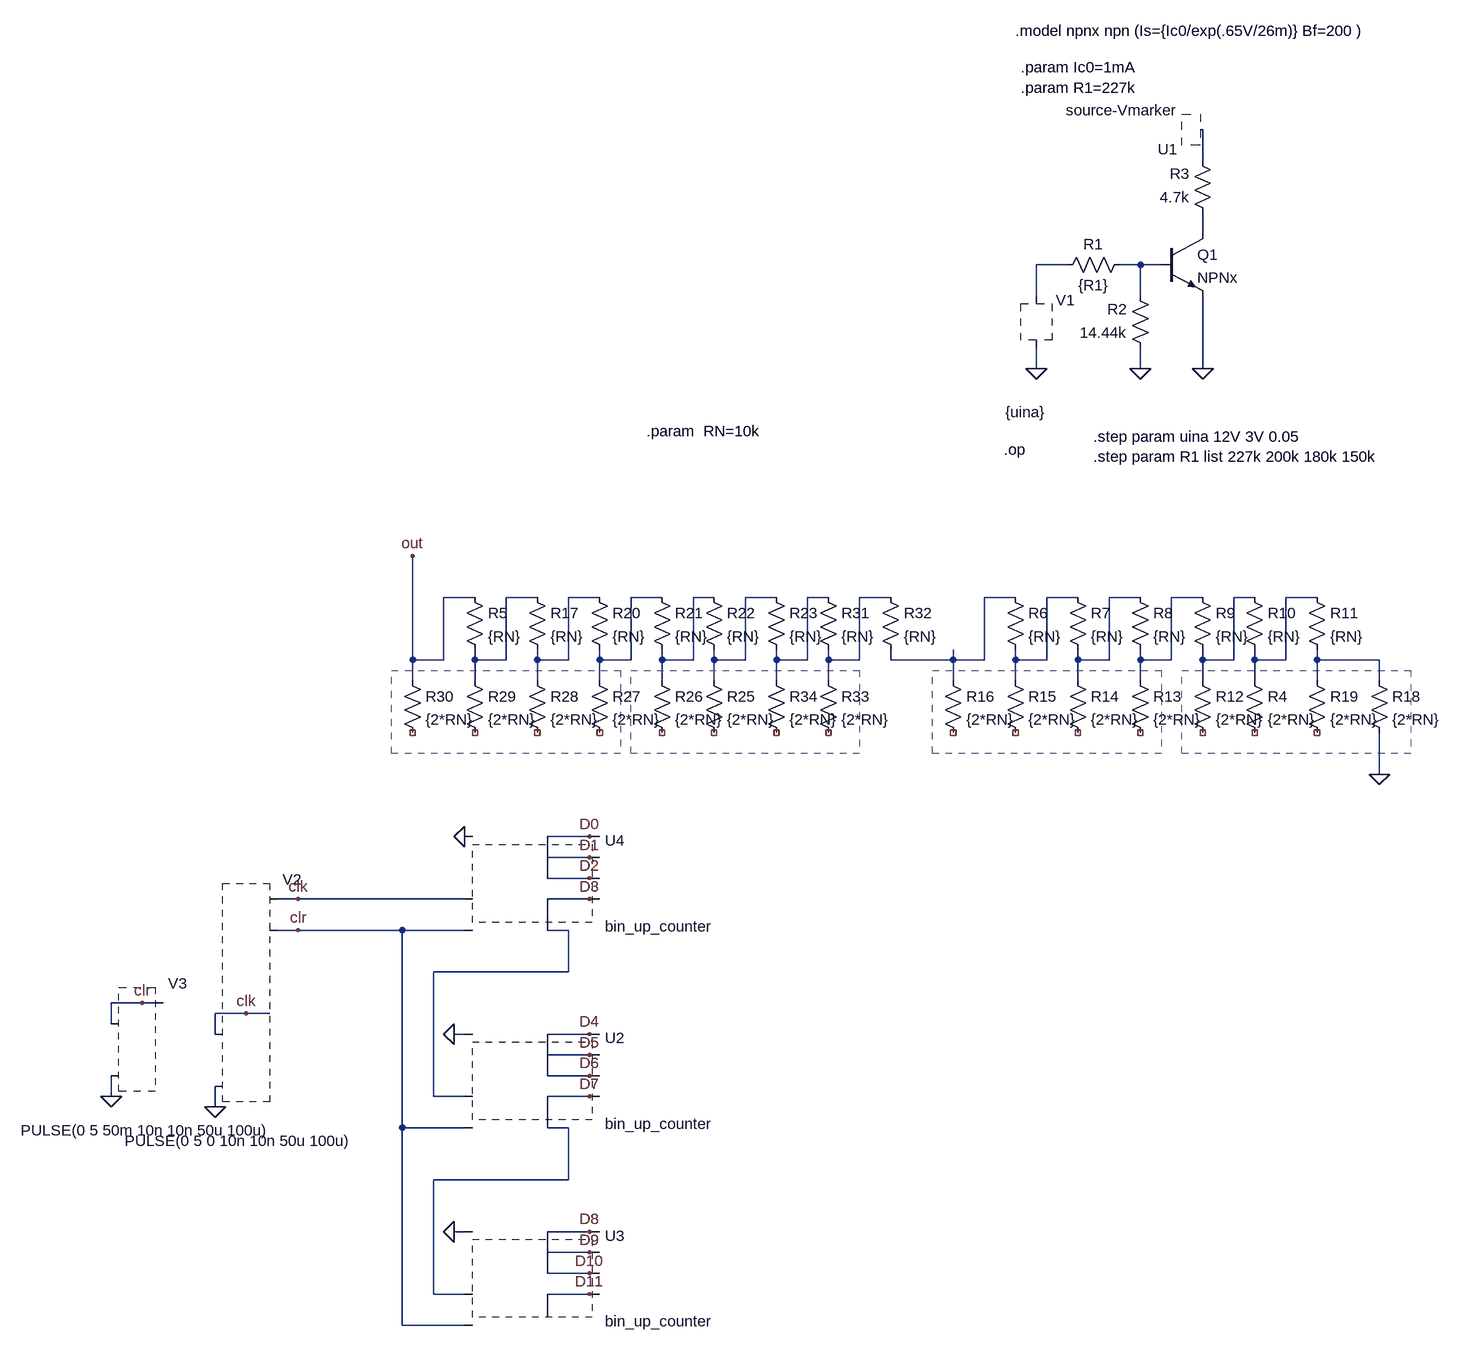
[diagram p0: schematic DAC_R2R_netzwerk.asc]
DAC_R2R_netzwerk.asc, the LTspice schematic file:
Version 4
SHEET 1 880 1584
WIRE 176 -256 176 -304
WIRE 176 -144 176 -176
WIRE -32 -96 -80 -96
WIRE 80 -96 48 -96
WIRE 112 -96 80 -96
WIRE -80 -48 -80 -96
WIRE 80 -48 80 -96
WIRE -80 64 -80 32
WIRE 80 64 80 32
WIRE 176 64 176 -48
WIRE -944 416 -992 416
WIRE -848 416 -896 416
WIRE -752 416 -800 416
WIRE -656 416 -704 416
WIRE -576 416 -608 416
WIRE -480 416 -528 416
WIRE -400 416 -432 416
WIRE -304 416 -352 416
WIRE -112 416 -160 416
WIRE -16 416 -64 416
WIRE 80 416 32 416
WIRE 176 416 128 416
WIRE 256 416 224 416
WIRE 352 416 304 416
WIRE -1040 512 -1040 352
WIRE -992 512 -992 416
WIRE -992 512 -1040 512
WIRE -944 512 -944 496
WIRE -896 512 -896 416
WIRE -896 512 -944 512
WIRE -848 512 -848 496
WIRE -800 512 -800 416
WIRE -800 512 -848 512
WIRE -752 512 -752 496
WIRE -704 512 -704 416
WIRE -704 512 -752 512
WIRE -656 512 -656 496
WIRE -608 512 -608 416
WIRE -608 512 -656 512
WIRE -576 512 -576 496
WIRE -528 512 -528 416
WIRE -528 512 -576 512
WIRE -480 512 -480 496
WIRE -432 512 -432 416
WIRE -432 512 -480 512
WIRE -400 512 -400 496
WIRE -352 512 -352 416
WIRE -352 512 -400 512
WIRE -304 512 -304 496
WIRE -208 512 -208 496
WIRE -208 512 -304 512
WIRE -160 512 -160 416
WIRE -160 512 -208 512
WIRE -112 512 -112 496
WIRE -64 512 -64 416
WIRE -64 512 -112 512
WIRE -16 512 -16 496
WIRE 32 512 32 416
WIRE 32 512 -16 512
WIRE 80 512 80 496
WIRE 128 512 128 416
WIRE 128 512 80 512
WIRE 176 512 176 496
WIRE 224 512 224 416
WIRE 224 512 176 512
WIRE 256 512 256 496
WIRE 304 512 304 416
WIRE 304 512 256 512
WIRE 352 512 352 496
WIRE 448 512 352 512
WIRE -1040 544 -1040 512
WIRE -944 544 -944 512
WIRE -848 544 -848 512
WIRE -752 544 -752 512
WIRE -656 544 -656 512
WIRE -576 544 -576 512
WIRE -480 544 -480 512
WIRE -400 544 -400 512
WIRE -208 544 -208 512
WIRE -112 544 -112 512
WIRE -16 544 -16 512
WIRE 80 544 80 512
WIRE 176 544 176 512
WIRE 256 544 256 512
WIRE 352 544 352 512
WIRE 448 544 448 512
WIRE 448 688 448 624
WIRE -768 784 -832 784
WIRE -752 784 -768 784
WIRE -768 816 -832 816
WIRE -752 816 -768 816
WIRE -768 848 -832 848
WIRE -752 848 -768 848
WIRE -1216 880 -1248 880
WIRE -960 880 -1216 880
WIRE -768 880 -832 880
WIRE -752 880 -768 880
WIRE -1216 928 -1248 928
WIRE -1056 928 -1216 928
WIRE -960 928 -1056 928
WIRE -800 928 -832 928
WIRE -800 992 -800 928
WIRE -800 992 -1008 992
WIRE -1456 1040 -1504 1040
WIRE -1424 1040 -1456 1040
WIRE -1296 1056 -1344 1056
WIRE -1264 1056 -1296 1056
WIRE -1504 1072 -1504 1040
WIRE -1344 1088 -1344 1056
WIRE -960 1088 -976 1088
WIRE -768 1088 -832 1088
WIRE -752 1088 -768 1088
WIRE -768 1120 -832 1120
WIRE -752 1120 -768 1120
WIRE -768 1152 -832 1152
WIRE -752 1152 -768 1152
WIRE -1504 1184 -1504 1152
WIRE -1008 1184 -1008 992
WIRE -960 1184 -1008 1184
WIRE -768 1184 -832 1184
WIRE -752 1184 -768 1184
WIRE -1344 1200 -1344 1168
WIRE -1056 1232 -1056 928
WIRE -960 1232 -1056 1232
WIRE -800 1232 -832 1232
WIRE -800 1312 -800 1232
WIRE -800 1312 -1008 1312
WIRE -960 1392 -976 1392
WIRE -768 1392 -832 1392
WIRE -752 1392 -768 1392
WIRE -768 1424 -832 1424
WIRE -752 1424 -768 1424
WIRE -768 1456 -832 1456
WIRE -752 1456 -768 1456
WIRE -1008 1488 -1008 1312
WIRE -960 1488 -1008 1488
WIRE -768 1488 -832 1488
WIRE -752 1488 -768 1488
WIRE -1056 1536 -1056 1232
WIRE -960 1536 -1056 1536
FLAG 80 64 0
FLAG 176 64 0
FLAG -80 64 0
FLAG 448 688 0
FLAG -1040 352 out
FLAG -1344 1200 0
FLAG -1296 1056 clk
FLAG -768 784 D0
FLAG -768 816 D1
FLAG -768 848 D2
FLAG -768 880 D3
FLAG -768 1088 D4
FLAG -768 1120 D5
FLAG -768 1152 D6
FLAG -768 1184 D7
FLAG -768 1392 D8
FLAG -768 1424 D9
FLAG -768 1456 D10
FLAG -768 1488 D11
FLAG -976 1088 0
FLAG -976 1392 0
FLAG -1216 880 clk
FLAG -960 784 0
FLAG -1504 1184 0
FLAG -1456 1040 clr
FLAG -1216 928 clr
SYMBOL EIT_Semiconductors\\npn 112 -144 R0
SYMATTR InstName Q1
SYMATTR Value NPNx
SYMBOL res 64 -112 R90
WINDOW 0 0 56 VBottom 2
WINDOW 3 32 56 VTop 2
SYMATTR InstName R1
SYMATTR Value {R1}
SYMBOL res 96 48 R180
WINDOW 0 36 76 Left 2
WINDOW 3 36 40 Left 2
SYMATTR InstName R2
SYMATTR Value 14.44k
SYMBOL res 192 -160 R180
WINDOW 0 36 76 Left 2
WINDOW 3 36 40 Left 2
SYMATTR InstName R3
SYMATTR Value 4.7k
SYMBOL source-V -80 -64 R0
WINDOW 3 -48 195 Left 2
WINDOW 123 0 0 Left 2
WINDOW 39 0 0 Left 2
SYMATTR InstName V1
SYMATTR Value {uina}
SYMBOL source-Vmarker 176 -304 R180
SYMATTR InstName U1
SYMBOL res -128 400 R0
SYMATTR InstName R6
SYMATTR Value {RN}
SYMBOL res -32 400 R0
SYMATTR InstName R7
SYMATTR Value {RN}
SYMBOL res 64 400 R0
SYMATTR InstName R8
SYMATTR Value {RN}
SYMBOL res 160 400 R0
SYMATTR InstName R9
SYMATTR Value {RN}
SYMBOL res 240 400 R0
SYMATTR InstName R10
SYMATTR Value {RN}
SYMBOL res 336 400 R0
SYMATTR InstName R11
SYMATTR Value {RN}
SYMBOL res 336 528 R0
SYMATTR InstName R19
SYMATTR Value {2*RN}
SYMBOL res 240 528 R0
SYMATTR InstName R4
SYMATTR Value {2*RN}
SYMBOL res 160 528 R0
SYMATTR InstName R12
SYMATTR Value {2*RN}
SYMBOL res 64 528 R0
SYMATTR InstName R13
SYMATTR Value {2*RN}
SYMBOL res -32 528 R0
SYMATTR InstName R14
SYMATTR Value {2*RN}
SYMBOL res -128 528 R0
SYMATTR InstName R15
SYMATTR Value {2*RN}
SYMBOL res -224 528 R0
SYMATTR InstName R16
SYMATTR Value {2*RN}
SYMBOL res 432 528 R0
SYMATTR InstName R18
SYMATTR Value {2*RN}
SYMBOL res -960 400 R0
SYMATTR InstName R5
SYMATTR Value {RN}
SYMBOL res -864 400 R0
SYMATTR InstName R17
SYMATTR Value {RN}
SYMBOL res -768 400 R0
SYMATTR InstName R20
SYMATTR Value {RN}
SYMBOL res -672 400 R0
SYMATTR InstName R21
SYMATTR Value {RN}
SYMBOL res -592 400 R0
SYMATTR InstName R22
SYMATTR Value {RN}
SYMBOL res -496 400 R0
SYMATTR InstName R23
SYMATTR Value {RN}
SYMBOL res -592 528 R0
SYMATTR InstName R25
SYMATTR Value {2*RN}
SYMBOL res -672 528 R0
SYMATTR InstName R26
SYMATTR Value {2*RN}
SYMBOL res -768 528 R0
SYMATTR InstName R27
SYMATTR Value {2*RN}
SYMBOL res -864 528 R0
SYMATTR InstName R28
SYMATTR Value {2*RN}
SYMBOL res -960 528 R0
SYMATTR InstName R29
SYMATTR Value {2*RN}
SYMBOL res -1056 528 R0
SYMATTR InstName R30
SYMATTR Value {2*RN}
SYMBOL res -416 400 R0
SYMATTR InstName R31
SYMATTR Value {RN}
SYMBOL res -320 400 R0
SYMATTR InstName R32
SYMATTR Value {RN}
SYMBOL res -416 528 R0
SYMATTR InstName R33
SYMATTR Value {2*RN}
SYMBOL res -496 528 R0
SYMATTR InstName R34
SYMATTR Value {2*RN}
SYMBOL EIT_Digital\\bin_up_counter -960 1088 R0
SYMATTR InstName U2
SYMBOL EIT_Digital\\bin_up_counter -960 1392 R0
SYMATTR InstName U3
SYMBOL source-V -1344 1072 R0
WINDOW 3 -139 180 Left 2
WINDOW 123 0 0 Left 2
WINDOW 39 0 0 Left 2
SYMATTR InstName V2
SYMATTR Value PULSE(0 5 0 10n 10n 50u 100u)
SYMBOL EIT_Digital\\bin_up_counter -960 784 R0
SYMATTR InstName U4
SYMBOL source-V -1504 1056 R0
WINDOW 3 -139 180 Left 2
WINDOW 123 0 0 Left 2
WINDOW 39 0 0 Left 2
SYMATTR InstName V3
SYMATTR Value PULSE(0 5 50m 10n 10n 50u 100u)
TEXT -104 -400 Left 2 !.param Ic0=1mA\n.param R1=227k
TEXT 8 168 Left 2 !.step param uina 12V 3V 0.05\n.step param R1 list 227k 200k 180k 150k
TEXT -130 188 Left 2 !.op
TEXT -112 -456 Left 2 !.model npnx npn (Is={Ic0/exp(.65V/26m)} Bf=200 )
TEXT -680 160 Left 2 !.param  RN=10k
RECTANGLE Normal 144 528 496 656 2
RECTANGLE Normal -240 528 112 656 2
RECTANGLE Normal -704 528 -352 656 2
RECTANGLE Normal -1072 528 -720 656 2

The netlist it stands for:
* DAC_R2R_netzwerk.asc
Q1 N002 N004 0 0 NPNx
R1 N004 N003 {R1}
R2 0 N004 14.44k
R3 N002 N001 4.7k
* V1: {uina} (symbol source-V not available, pin order unknown); nets seen at it: 0, N003
* U1: source-Vmarker (symbol source-Vmarker not available, pin order unknown); nets seen at it: N001
R6 N012 N013 {RN}
R7 N013 N014 {RN}
R8 N014 N015 {RN}
R9 N015 N016 {RN}
R10 N016 N017 {RN}
R11 N017 N018 {RN}
R19 N018 NC_01 {2*RN}
R4 N017 NC_02 {2*RN}
R12 N016 NC_03 {2*RN}
R13 N015 NC_04 {2*RN}
R14 N014 NC_05 {2*RN}
R15 N013 NC_06 {2*RN}
R16 N012 NC_07 {2*RN}
R18 N018 0 {2*RN}
R5 out N005 {RN}
R17 N005 N006 {RN}
R20 N006 N007 {RN}
R21 N007 N008 {RN}
R22 N008 N009 {RN}
R23 N009 N010 {RN}
R25 N009 NC_08 {2*RN}
R26 N008 NC_09 {2*RN}
R27 N007 NC_10 {2*RN}
R28 N006 NC_11 {2*RN}
R29 N005 NC_12 {2*RN}
R30 out NC_13 {2*RN}
R31 N010 N011 {RN}
R32 N011 N012 {RN}
R33 N011 NC_14 {2*RN}
R34 N010 NC_15 {2*RN}
* U2: bin_up_counter (symbol EIT_Digital\bin_up_counter not available, pin order unknown); nets seen at it: 0, clr, D4, D5, D6, D7, N019, N020
* U3: bin_up_counter (symbol EIT_Digital\bin_up_counter not available, pin order unknown); nets seen at it: 0, clr, D10, D11, D8, D9, N020
* V2: PULSE(0 5 0 10n 10n 50u 100u) (symbol source-V not available, pin order unknown); nets seen at it: 0, clk, clr
* U4: bin_up_counter (symbol EIT_Digital\bin_up_counter not available, pin order unknown); nets seen at it: 0, clk, clr, D0, D1, D2, D3, N019
* V3: PULSE(0 5 50m 10n 10n 50u 100u) (symbol source-V not available, pin order unknown); nets seen at it: 0, clr
.model NPN NPN
.model PNP PNP
.lib standard.bjt
.param Ic0=1mA
.param R1=227k
.step param uina 12V 3V 0.05
.step param R1 list 227k 200k 180k 150k
.op
.model npnx npn (Is={Ic0/exp(.65V/26m)} Bf=200 )
.param  RN=10k
.backanno
.end